# Altium schematic sheet DAC_SET2.SchDoc
size A4; SheetNumber: 5; SheetTotal: 5
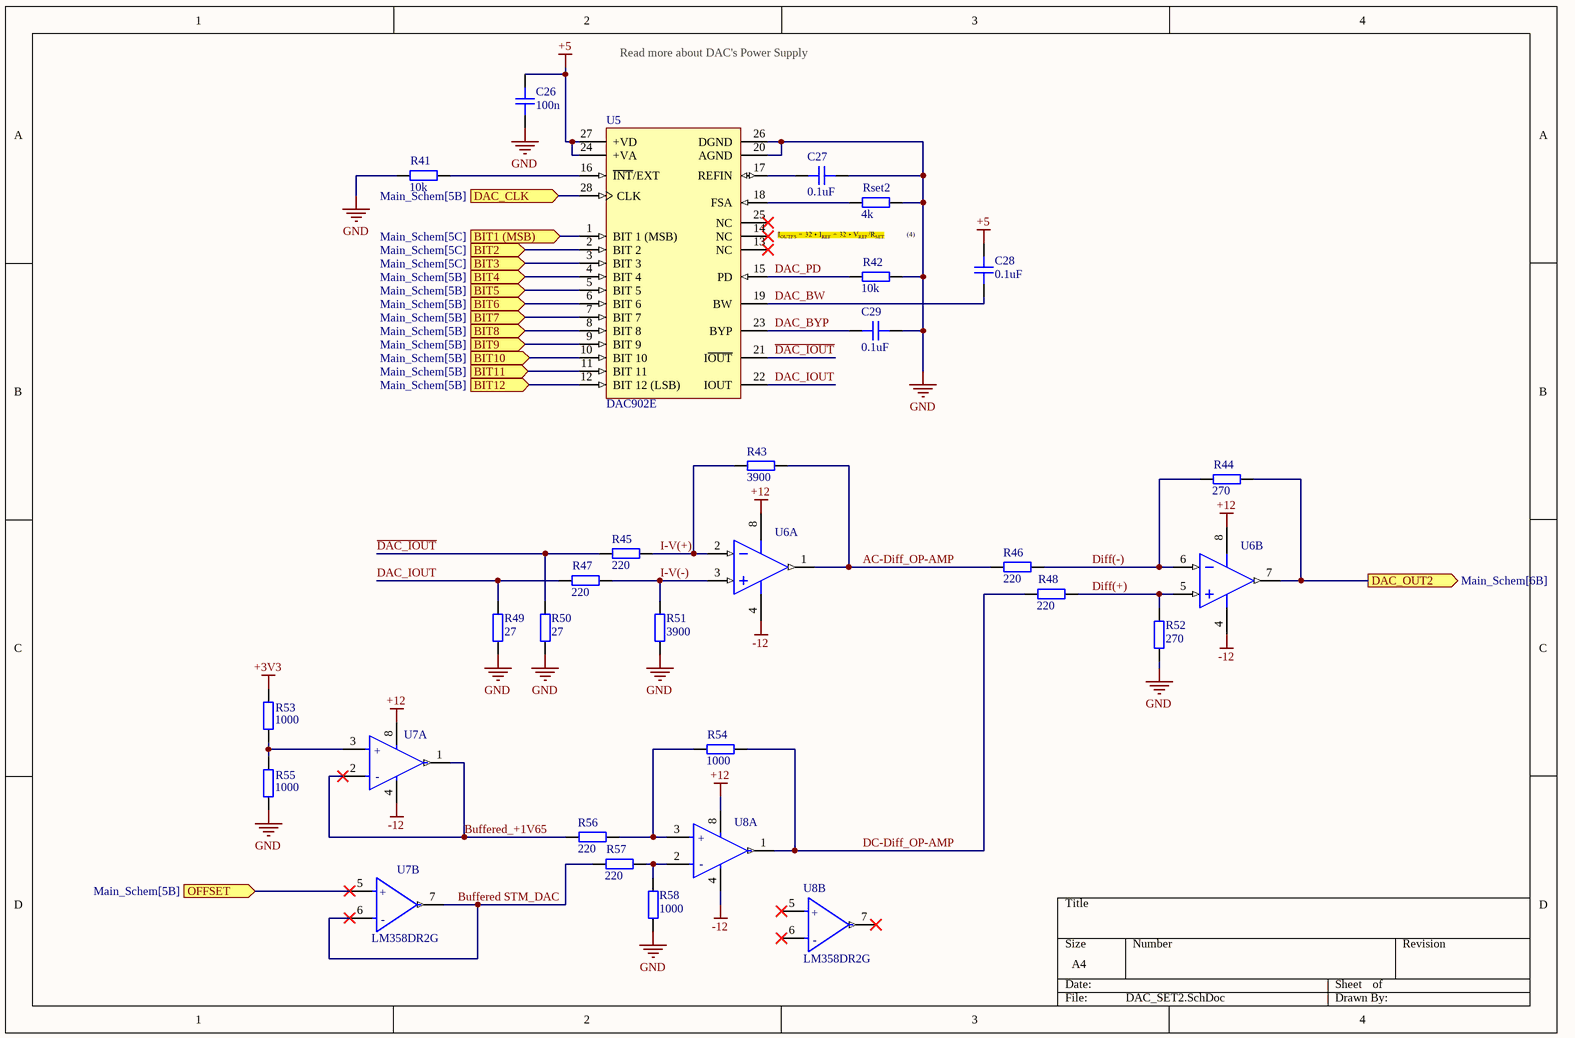
[diagram p0: DAC_SET2.SchDoc]

## Parts
C26  100n  [CAP_0805]
C27  0.1uF  [CAP_1210]
C28  0.1uF  [CAP_1210]
C29  0.1uF  [CAP_1210]
R41  10k  [RES_0805]
R42  10k  [RES_0805]
R43  3900  [RES_0805]
R44  270  [RES_0805]
R45  220  [RES_0805]
R46  220  [RES_0805]
R47  220  [RES_0805]
R48  220  [RES_0805]
R49  27  [RES_0805]
R50  27  [RES_0805]
R51  3900  [RES_0805]
R52  270  [RES_0805]
R53  1000  [RES_0805]
R54  1000  [RES_0805]
R55  1000  [RES_0805]
R56  220  [RES_0805]
R57  220  [RES_0805]
R58  1000  [RES_0805]
Rset2  4k  [RES_0805]
U5  DAC902E  [TI-PW28_L]
U6  AD8066ARZ-R7  [ADI-R-8_M]  (value not drawn)  (parts A,B of 2)
U7  LM358DR2G  [FP-751-07-IPC_C]  (value not drawn)  (parts A,B of 2)
U8  LM358DR2G  [FP-751-07-IPC_C]  (value not drawn)  (parts A,B of 2)

## Ports
BIT1 (MSB) (in, see Main_Schem[5C]), BIT2 (in, see Main_Schem[5C]), BIT3 (in, see Main_Schem[5C]), BIT4 (in, see Main_Schem[5B]), BIT5 (in, see Main_Schem[5B]), BIT6 (in, see Main_Schem[5B]), BIT7 (in, see Main_Schem[5B]), BIT8 (in, see Main_Schem[5B]), BIT9 (in, see Main_Schem[5B]), BIT10 (in, see Main_Schem[5B]), BIT11 (in, see Main_Schem[5B]), BIT12 (in, see Main_Schem[5B]), DAC_CLK (in, see Main_Schem[5B]), DAC_OUT2 (out, see Main_Schem[6B]), OFFSET (in, see Main_Schem[5B])

## Nets
+3V3: R53.1
+5: C26.2 C28.2 U5.24(+VA) U5.27(+VD)
+12: U6.8(+VS) U7.8(VCC) U8.8(VCC)
-12: U6.4(-VS) U7.4(VEE/GND) U8.4(VEE/GND)
GND: C26.1 C27.2 C29.2 R41.2 R42.1 R49.2 R50.2 R51.2 R52.2 R55.2 R58.2 Rset2.1 U5.20(AGND) U5.26(DGND)
~{DAC_IOUT}: R45.2 R50.1 U5.21(I~{OUT})
AC-Diff_OP-AMP: R43.2 R46.2 U6.1(VOUT_1)
BIT1 (MSB): U5.1(BIT_1_(MSB)) ; port BIT1 (MSB)
BIT2: U5.2(BIT_2) ; port BIT2
BIT3: U5.3(BIT_3) ; port BIT3
BIT4: U5.4(BIT_4) ; port BIT4
BIT5: U5.5(BIT_5) ; port BIT5
BIT6: U5.6(BIT_6) ; port BIT6
BIT7: U5.7(BIT_7) ; port BIT7
BIT8: U5.8(BIT_8) ; port BIT8
BIT9: U5.9(BIT_9) ; port BIT9
BIT10: U5.10(BIT_10) ; port BIT10
BIT11: U5.11(BIT_11) ; port BIT11
BIT12: U5.12(BIT_12_(LSB)) ; port BIT12
Buffered STM_DAC: R57.2 U7.6(INPUT_B-) U7.7(OUTPUT_B)
Buffered_+1V65: R56.2 U7.1(OUTPUT_A) U7.2(INPUT_A-)
DAC_BW: C28.1 U5.19(BW)
DAC_BYP: C29.1 U5.23(BYP)
DAC_CLK: U5.28(CLK) ; port DAC_CLK
DAC_IOUT: R47.2 R49.1 U5.22(IOUT)
DAC_OUT2: R44.1 U6.7(VOUT_2) ; port DAC_OUT2
DAC_PD: R42.2 U5.15(PD)
DC-Diff_OP-AMP: R48.2 R54.1 U8.1(OUTPUT_A)
Diff(+): R48.1 R52.1 U6.5(+IN_2)
Diff(-): R44.2 R46.1 U6.6(-IN_2)
I-V(+): R43.1 R45.1 U6.2(-IN_1)
I-V(-): R47.1 R51.1 U6.3(+IN_1)
OFFSET: U7.5(INPUT_B+) ; port OFFSET
NetC27_1: C27.1 U5.17(REFIN)
NetR41_1: R41.1 U5.16(~{INT}/EXT)
NetR53_2: R53.2 R55.1 U7.3(INPUT_A+)
NetR54_2: R54.2 R56.1 U8.3(INPUT_A+)
NetR57_1: R57.1 R58.1 U8.2(INPUT_A-)
NetRset2_2: Rset2.2 U5.18(FSA)

Not connected (* = marked no-connect by the designer): U5 13(NC)* 14(NC)* 25(NC)*; U8 5(INPUT_B+)* 6(INPUT_B-)* 7(OUTPUT_B)*

## Notes on the sheet
- Read more about DAC's Power Supply
- (in symbol CMP-1310-00291-2, part A) +; -
- (in symbol CMP-1310-00291-2, part B) +; -

## Library data of the parts
C26 = CAP_0805: Capacitor SMD 0805; Manufacturer: *; Manufacturer Part Number: *; Distributor Link: *; LCSC: *; Rating: *; Dielectric: *
C27-C29 = CAP_1210: Capacitor SMD 1210; Manufacturer: *; Manufacturer Part Number: *; Distributor Link: *; LCSC: *; Rating: *; Dielectric: *
R41-R58 Rset2 = RES_0805: Resistor SMD 0805; Manufacturer: *; Manufacturer Part Number: *; Distributor Link: *; LCSC: *
U5 = CMP-0004-01382-1: 12-Bit, 165 MSPS SpeedPlus(TM) DAC Scalable Current Outputs between 2 to 20 mA, -40 to 85 degC, 28-pin SOP (PW28), Green (RoHS & no Sb/Br); Manufacturer: Texas Instruments; Settling Time(us): 0.03; Power Consumption(Typ)(mW): 170; SFDR(dB): 75; DNL(Max)(+/-LSB): 1.75; INL(Max)(+/-LSB): 2.5; Resolution(Bits): 12; Interface: Parallel CMOS; DAC Channels: 1; SubFamily: High Speed DAC (>10MSPS); ComponentLink3Description: Package Specification; ComponentLink2Description: Datasheet; Code_JEDEC: MO-153; Eco-Plan: Green (RoHS & no Sb/Br); Mounting Technology: Surface Mount; ComponentLink1URL: http://www.ti.com/; PackageDescription: 28-Pin Plastic Small Outline, Body 9.7 x 4.4 mm, Pitch 0.65 mm; PackageVersion: 4040064-7/G, 02/2011; ComponentLink1Description: Manufacturer URL; DatasheetVersion: SBAS094B; ComponentLink3URL: http://www.ti.com/litv/pdf/mpds364; ComponentLink2URL: http://www.ti.com/general/docs/lit/getliterature.tsp?genericPartNumber=DAC902&fileType=pdf; PackageReference: PW28; PartNumber: DAC902E
U6 = CMP-0384-01346-2: Double Channel Low Power Operational Amplifier, 145 MHz BW, 180 V/us SR, Industrial, 8-pin SOIC (R-8), Reel; Manufacturer: Analog Devices; Generic Part Number: AD8066; Small Signal Bandwidth: 145MHz; V Span Min: 5V; Input Offset Voltage: 400uV; V Span Max: 24V; Input Bias Current: 2pA; Amplifiers Per Package: 2; Iq/Amp: 7.4mA; ComponentLink1URL: http://www.analog.com/en/index.html; ComponentLink4Description: Reference Circuit; ComponentLink3URL: http://www.analog.com/static/imported-files/packages/PKG_PDF/SOIC_Narrow%20(R)/R_8.pdf; Code_JEDEC: MS-012-AA; ComponentLink3Description: Package Specification; ComponentLink4URL: http://www.analog.com/en/all-operational-amplifiers-op-amps/operational-amplifiers-op-amps/ad8066/products/product.html#product-recommendations; RevisionNote: Reference Circuit URL fixed; ComponentLink1Description: Manufacturer URL; PackageDescription: 8-Pin Standard Small Outline Package, Body 3.9 x 4.9 mm, Pitch 1.27 mm; PackageReference: R-8; Slew Rate: 180V/us; PackageVersion: 060506-A; Mounting Technology: Surface Mount; ComponentLink2Description: Datasheet; ComponentLink2URL: http://www.analog.com/static/imported-files/data_sheets/AD8065_8066.pdf; PartNumber: AD8066ARZ-R7; DatasheetVersion: Rev. J
U7 U8 = CMP-1310-00291-2: IC OPAMP GP 2 CIRCUIT 8SOIC; Gain Bandwidth Product: 1MHz; Number of Circuits: 2; Min Supply Voltage: 3V; Slew Rate: 0.6V/µs; Max Dual Supply Voltage: 16V; Common Mode Rejection Ratio: 65dB; Input Bias Current: 250nA; Min Dual Supply Voltage: 1.5V; Dual Supply Voltage: 9V; Operating Supply Current: 1.5mA; Output Current: 40mA; Input Offset Voltage (Vos): 7mV; Nominal Supply Current: 1.2mA; Voltage Gain: 100dB; Max Supply Voltage: 32V; Width: 4mm; Number of Pins: 8; Min Operating Temperature: 0°C; REACH SVHC: No SVHC; Contact Plating: Tin; Lead Free: Lead Free; Halogen Free: Halogen Free; Power Supply Rejection Ratio (PSRR): 65dB; Operating Supply Voltage: 16V; Package Quantity: 2500; Max Operating Temperature: 70°C; Case/Package: SOIC; Height: 1.5mm; Packaging: Tape and Reel; Radiation Hardening: No; Number of Channels: 2; Bandwidth: 1MHz; Length: 5mm; Number of Elements: 2; Number of Amplifiers: 2; Output Current per Channel: 40mA